# Altium schematic sheet CONNECTEUR_2.SchDoc: DARKYDEN_CONNECTEUR_2
size Letter; ApprovedBy: APPROUVÉ PAR; Author: Harold Malbrouck; Organization: Cegep Limoilou; Address1: 1300, 8e Avenue; Address2: Québec, QC; Address3: Canada; Address4: G1J 5L5; Revision: Rev.B; SheetNumber: 13; SheetTotal: 22
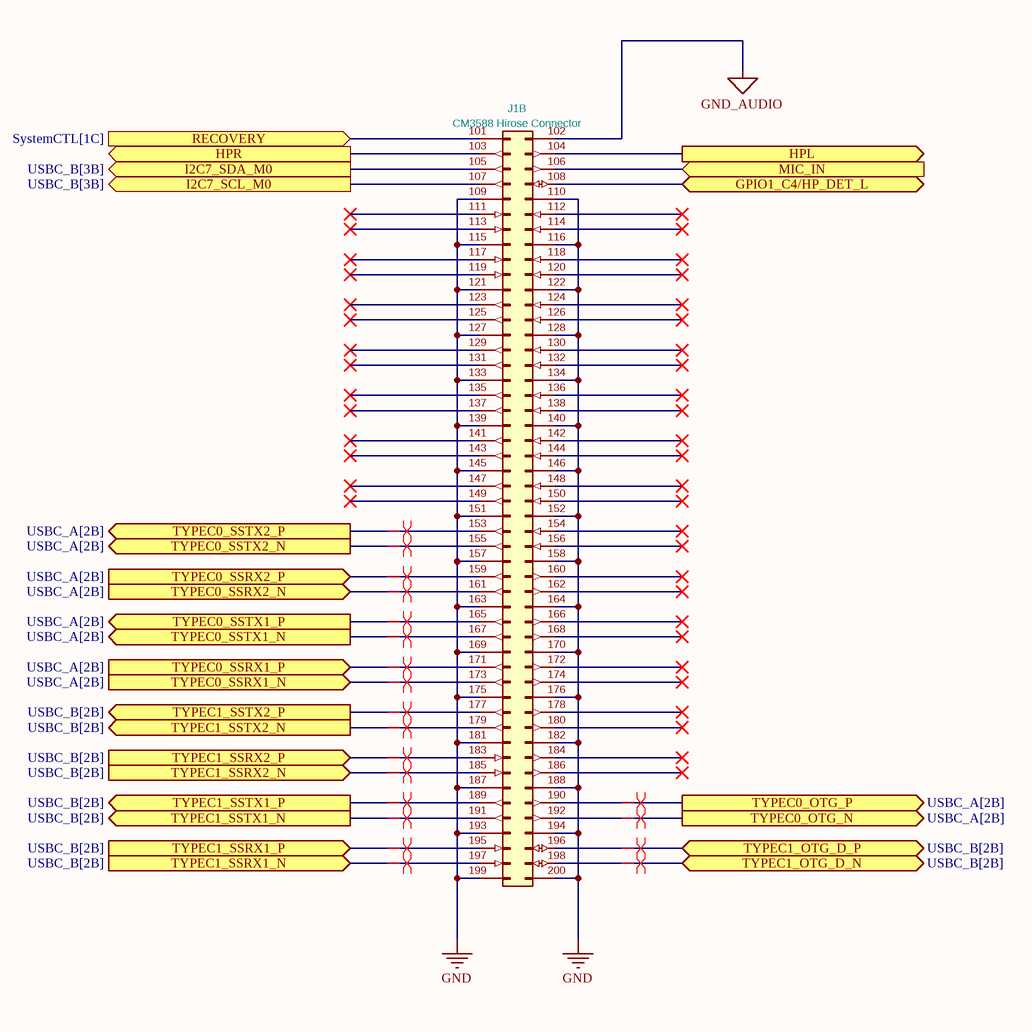
[diagram p0: CONNECTEUR_2.SchDoc, middle]

## Parts
J1  CM3588 Hirose Connector  [CM3588]  (part B of 4)

## Ports
GPIO1_C4/HP_DET_L (bidir), HPL (out), HPR (out), I2C7_SCL_M0 (out, see USBC_B[3B]), I2C7_SDA_M0 (out, see USBC_B[3B]), MIC_IN (in), RECOVERY (in, see SystemCTL[1C]), TYPEC0_OTG_N (out, see USBC_A[2B]), TYPEC0_OTG_P (out, see USBC_A[2B]), TYPEC0_SSRX1_N (in, see USBC_A[2B]), TYPEC0_SSRX1_P (in, see USBC_A[2B]), TYPEC0_SSRX2_N (in, see USBC_A[2B]), TYPEC0_SSRX2_P (in, see USBC_A[2B]), TYPEC0_SSTX1_N (out, see USBC_A[2B]), TYPEC0_SSTX1_P (out, see USBC_A[2B]), TYPEC0_SSTX2_N (out, see USBC_A[2B]), TYPEC0_SSTX2_P (out, see USBC_A[2B]), TYPEC1_OTG_D_N (bidir, see USBC_B[2B]), TYPEC1_OTG_D_P (bidir, see USBC_B[2B]), TYPEC1_SSRX1_N (in, see USBC_B[2B]), TYPEC1_SSRX1_P (in, see USBC_B[2B]), TYPEC1_SSRX2_N (in, see USBC_B[2B]), TYPEC1_SSRX2_P (in, see USBC_B[2B]), TYPEC1_SSTX1_N (out, see USBC_B[2B]), TYPEC1_SSTX1_P (out, see USBC_B[2B]), TYPEC1_SSTX2_N (out, see USBC_B[2B]), TYPEC1_SSTX2_P (out, see USBC_B[2B])

## Nets
GND: J1.109(GND) J1.110(GND) J1.115(GND) J1.116(GND) J1.121(GND) J1.122(GND) J1.127(GND) J1.128(GND) J1.133(GND) J1.134(GND) J1.139(GND) J1.140(GND) J1.145(GND) J1.146(GND) J1.151(GND) J1.152(GND) J1.157(GND) J1.158(GND) J1.163(GND) J1.164(GND) J1.169(GND) J1.170(GND) J1.175(GND) J1.176(GND) J1.181(GND) J1.182(GND) J1.187(GND) J1.188(GND) J1.193(GND) J1.194(GND) J1.199(GND) J1.200(GND)
GND_AUDIO: J1.102(GND_AUDUO)
GPIO1_C4/HP_DET_L: J1.108(GPIO1_C4/HP_DET_L) ; port GPIO1_C4/HP_DET_L
HPL: J1.104(HPL) ; port HPL
HPR: J1.103(HPR) ; port HPR
I2C7_SCL_M0: J1.107(I2C7_SCL_M0) ; port I2C7_SCL_M0
I2C7_SDA_M0: J1.105(I2C7_SDA_M0) ; port I2C7_SDA_M0
MIC_IN: J1.106(MIC_IN) ; port MIC_IN
RECOVERY: J1.101(RECOVERY) ; port RECOVERY
TYPEC0_OTG_N: J1.192(TYPEC0_OTG_DM) ; port TYPEC0_OTG_N
TYPEC0_OTG_P: J1.190(TYPEC0_OTG_DP) ; port TYPEC0_OTG_P
TYPEC0_SSRX1_N: J1.173(TYPEC0_SSRX1N) ; port TYPEC0_SSRX1_N
TYPEC0_SSRX1_P: J1.171(TYPEC0_SSRX1P) ; port TYPEC0_SSRX1_P
TYPEC0_SSRX2_N: J1.161(TYPEC0_SSRX2N) ; port TYPEC0_SSRX2_N
TYPEC0_SSRX2_P: J1.159(TYPEC0_SSRX2P) ; port TYPEC0_SSRX2_P
TYPEC0_SSTX1_N: J1.167(TYPEC0_SSTX1N) ; port TYPEC0_SSTX1_N
TYPEC0_SSTX1_P: J1.165(TYPEC0_SSTX1P) ; port TYPEC0_SSTX1_P
TYPEC0_SSTX2_N: J1.155(TYPEC0_SSTX2N) ; port TYPEC0_SSTX2_N
TYPEC0_SSTX2_P: J1.153(TYPEC0_SSTX2P) ; port TYPEC0_SSTX2_P
TYPEC1_OTG_D_N: J1.198(TYPEC1_OTG_DM) ; port TYPEC1_OTG_D_N
TYPEC1_OTG_D_P: J1.196(TYPEC1_OTG_DP) ; port TYPEC1_OTG_D_P
TYPEC1_SSRX1_N: J1.197(TYPEC1_SSRX1N) ; port TYPEC1_SSRX1_N
TYPEC1_SSRX1_P: J1.195(TYPEC1_SSRX1P) ; port TYPEC1_SSRX1_P
TYPEC1_SSRX2_N: J1.185(TYPEC1_SSRX2N) ; port TYPEC1_SSRX2_N
TYPEC1_SSRX2_P: J1.183(TYPEC1_SSRX2P) ; port TYPEC1_SSRX2_P
TYPEC1_SSTX1_N: J1.191(TYPEC1_SSTX1N) ; port TYPEC1_SSTX1_N
TYPEC1_SSTX1_P: J1.189(TYPEC1_SSTX1P) ; port TYPEC1_SSTX1_P
TYPEC1_SSTX2_N: J1.179(TYPEC1_SSTX2N) ; port TYPEC1_SSTX2_N
TYPEC1_SSTX2_P: J1.177(TYPEC1_SSTX2P) ; port TYPEC1_SSTX2_P

Not connected (* = marked no-connect by the designer): J1 111(MIPI_DPHY0_RX_D2P)* 112(MIPI_DPHY0_RX_D3P)* 113(MIPI_DPHY0_RX_D2N)* 114(MIPI_DPHY0_RX_D3N)* 117(MIPI_DPHY0_RX_D1P)* 118(MIPI_DPHY0_RX_CLKP)* 119(MIPI_DPHY0_RX_D1N)* 120(MIPI_DPHY0_RX_CLKN)* 123(MIPI_DPHY0_TX_D3P)* 124(MIPI_DPHY0_RX_D0P)* 125(MIPI_DPHY0_TX_D3N)* 126(MIPI_DPHY0_RX_D0N)* 129(MIPI_DPHY0_TX_D2P)* 130(MIPI_DPHY1_RX_D3P)* 131(MIPI_DPHY0_TX_D2N)* 132(MIPI_DPHY1_RX_D3N)* 135(MIPI_DPHY0_TX_CLKP)* 136(MIPI_DPHY1_RX_D2P)* 137(MIPI_DPHY0_TX_CLKN)* 138(MIPI_DPHY1_RX_D2N)* 141(MIPI_DPHY0_TX_D1P)* 142(MIPI_DPHY1_RX_CLKP)* 143(MIPI_DPHY0_TX_D1N)* 144(MIPI_DPHY1_RX_CLKN)* 147(MIPI_DPHY0_TX_D0P)* 148(MIPI_DPHY1_RX_D1P)* 149(MIPI_DPHY0_TX_D0N)* 150(MIPI_DPHY1_RX_D1N)* 154(MIPI_DPHY1_RX_D0P)* 156(MIPI_DPHY1_RX_D0N)* 160(MIPI_DPHY1_TX_D3P)* 162(MIPI_DPHY1_TX_D3N)* 166(MIPI_DPHY1_TX_D2P)* 168(MIPI_DPHY1_TX_D2N)* 172(MIPI_DPHY1_TX_CLKP)* 174(MIPI_DPHY1_TX_CLKN)* 178(MIPI_DPHY1_TX_D1P)* 180(MIPI_DPHY1_TX_D1N)* 184(MIPI_DPHY1_TX_D0P)* 186(MIPI_DPHY1_TX_D0N)*

## Layout directives
differential pair: TYPEC0_OTG_N, TYPEC0_OTG_P, TYPEC0_SSRX1_N, TYPEC0_SSRX1_P, TYPEC0_SSRX2_N, TYPEC0_SSRX2_P, TYPEC0_SSTX1_N, TYPEC0_SSTX1_P, TYPEC0_SSTX2_N, TYPEC0_SSTX2_P, TYPEC1_OTG_D_N, TYPEC1_OTG_D_P, TYPEC1_SSRX1_N, TYPEC1_SSRX1_P, TYPEC1_SSRX2_N, TYPEC1_SSRX2_P, TYPEC1_SSTX1_N, TYPEC1_SSTX1_P, TYPEC1_SSTX2_N, TYPEC1_SSTX2_P

## Notes on the sheet
- Titre :
- Conception :
- Date :
- Approbation :
- Heure :
- Révision :
- Feuille
- de
- Fichier :

## Library data of the parts
J1 = CM3588: LCSC: C597931; Footprint: Library:CM3588; Value: CM3588 Hirose Connector